# Altium schematic sheet Memory.SchDoc
size Letter; Author: Lihong; Chenwei; SheetNumber: 2; SheetTotal: 8
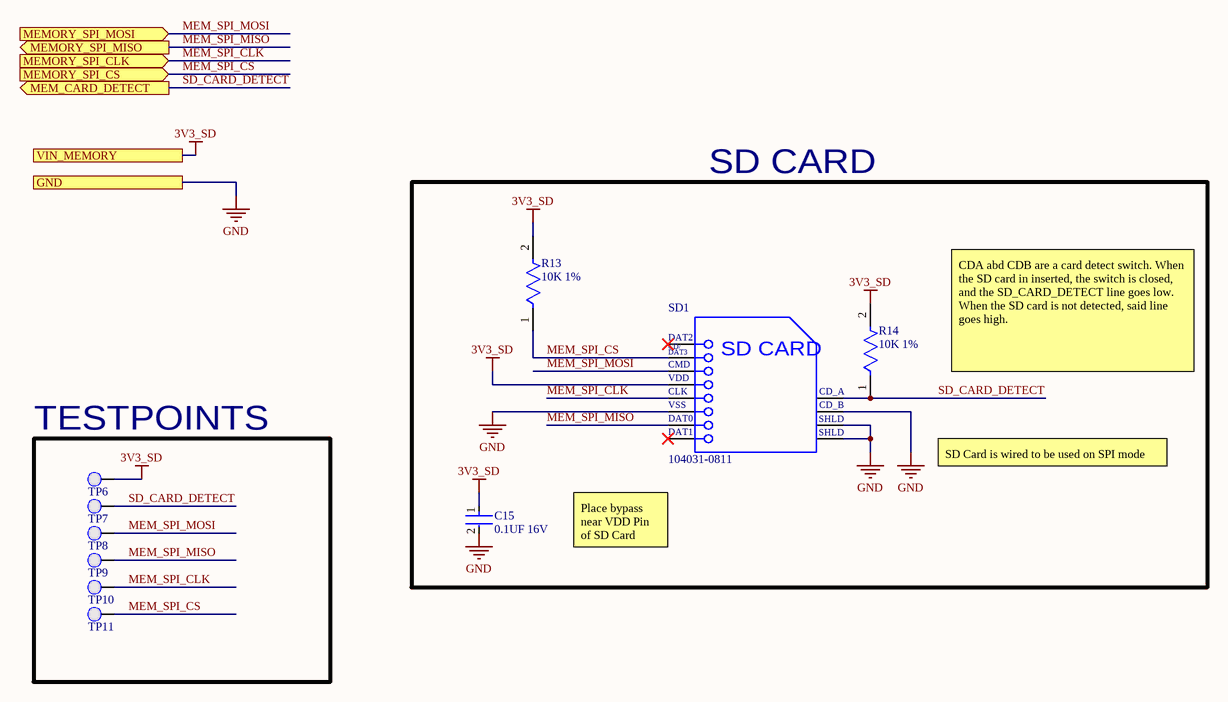
[diagram p0: Memory.SchDoc]

## Parts
C15  0.1UF 16V  [FP-CC0402-MFG]
R13  10K 1%  [FP-RNCP0603-IPC_A]
R14  10K 1%  [FP-RNCP0603-IPC_A]
SD1  104031-0811  [MOLX-104031-0811_V]
TP6  Test Point 0.1"  [Test Point 0.1"-Footprint-1]  (value not drawn)
TP7  Test Point 0.1"  [Test Point 0.1"-Footprint-1]  (value not drawn)
TP8  Test Point 0.1"  [Test Point 0.1"-Footprint-1]  (value not drawn)
TP9  Test Point 0.1"  [Test Point 0.1"-Footprint-1]  (value not drawn)
TP10  Test Point 0.1"  [Test Point 0.1"-Footprint-1]  (value not drawn)
TP11  Test Point 0.1"  [Test Point 0.1"-Footprint-1]  (value not drawn)

## Blocks framed on the sheet
SD CARD: C15 R13 R14 SD1
TESTPOINTS: TP6-TP11

## Ports
GND, MEM_CARD_DETECT (out), MEMORY_SPI_CLK (in), MEMORY_SPI_CS (in), MEMORY_SPI_MISO (out), MEMORY_SPI_MOSI (in), VIN_MEMORY

## Nets
3V3_SD: C15.1 R13.2 R14.2 SD1.4(VDD) TP6.1(PAD) ; port VIN_MEMORY
GND: C15.2 SD1.6(VSS2) SD1.10(CD_B) SD1.11(SHLD1) SD1.12(SHLD2) ; port GND
MEM_SPI_CLK: SD1.5(CLK) TP10.1(PAD) ; port MEMORY_SPI_CLK
MEM_SPI_CS: R13.1 SD1.2(CMD) TP11.1(PAD) ; port MEMORY_SPI_CS
MEM_SPI_MISO: SD1.7(DAT0) TP9.1(PAD) ; port MEMORY_SPI_MISO
MEM_SPI_MOSI: SD1.3(VSS1) TP8.1(PAD) ; port MEMORY_SPI_MOSI
SD_CARD_DETECT: R14.1 SD1.9(CD_A) TP7.1(PAD) ; port MEM_CARD_DETECT

Not connected (* = marked no-connect by the designer): SD1 1(CD/DAT3)* 8(DAT1)*

## Notes on the sheet
- CDA abd CDB are a card detect switch. When the SD card in inserted, the switch is closed, and the SD_CARD_DETECT line goes low. When the SD card is not detected, said line goes high.
- SD Card is wired to be used on SPI mode
- Place bypass near VDD Pin of SD Card
- Title:
- Desc:
- Size:
- Letter
- Auth:
- Proj:
- Sheet
- of
- www.seas.upenn.edu
- Electrical and Systems Engineering
- (in symbol CMP-2000-05825-1) DAT2; CD/; DAT3; SD CARD; VSS; SHLD

## Library data of the parts
C15 = CMP-03422-000946-1: CC0402 100 nF X7R 10.00% 25 V; Manufacturer Part Number: CC0402KPX7R8BB104; Manufacturer: YAGEO; Capacitance: 100 nF; Material: Ceramic; Tolerance: 0.1; Value: 100 nF; Temperature Coefficient: 30ppm/°C; Automotive Grade: NA; Voltage Rating: 25 V; Footprint Url: http://www.yageo.com/exep/pages/download/literatures/UPY-C_GEN_24.pdf; ComponentLink2Description: Datasheet; Device Class L2: Capacitors; Device Class L3: Ceramic Capacitors; Height: 0.55mm; Ipc Land Pattern Name: CAPC10050X50; Category: Cap; ComponentLink2URL: http://www.yageo.com/documents/recent/UPY-GP_NP0_16V-to-50V_16.pdf; Automotive: No; Temperature: -55°C to +125°C; Lead Free: Yes; Temperature Range High: +125°C; Temperature Range Low: -55°C; Temperature Characteristic: X7R; Package: CC0402; RoHS: TRUE; Octopart: https://octopart.com/cc0402kpx7r8bb104-yageo-61757486; Device Class L1: Passive Components
R13 R14 = CMP-26527-000099-1: 10kΩ ±1% 0.125W 0603 High Power Anti-Sulfur Thin Film Chip Resistor; Resistance: 10kR; Max Power Dissipation: 125mW; Temperature Coefficient: 100ppm/°C; Max Operating Temperature: 155°C; Width: 0.031inch; Height: 0.02inch; Lead Free: Lead Free; Contact Plating: Tin; Tolerance: 1%; Resistor Type: Thin Film; Series: RNCP; RoHS Compliant: Yes; Features: Moisture Resistant; Min Operating Temperature: -55°C; Case Code (Metric): 1608; Case/Package: 0603; Mount: Surface Mount; Packaging: Tape and Reel; Radiation Hardening: No; Length: 0.059inch; Number of Terminations: 2; Case Code (Imperial): 0603
SD1 = CMP-2000-05825-1: Micro SD Card, RA, -25 to 85 degC, 8-Pin SMD, RoHS, Tape and Reel; Voltage Rating: 10VAC/DC; Number of Contacts: 8; Insertion - Extraction Style: Push-Pull; Pitch: 1.1mm; Mating Cycles: 10000; Brand: Molex; Current Rating: 500mA; Manufacturer URL: http://www.molex.com/; Card Type: microSD; Mounting Type: Standard; Height: 1.42mm; Mounting Technology: SurfaceMount; Contact Plating: Gold; Product Category: MemoryCardConnectors; Package Description: 8-Pin Surface Mount Device, Body 11.95 x 11.4 mm, Pitch 1.1 mm; Datasheet URL: http://www.molex.com/pdm_docs/sd/1040310811_sd.pdf; Termination Style: SMD; Length: 11.4mm; Housing Material: LiquidCrystalPolymer(LCP); Orientation: RightAngle; RoHS: True; Contact Material: PhosphorBronze; Datasheet Version: Rev. E, 04/2006; Packaging: Reel; Manufacturer: Molex; Series: 104031; Product: CardConnectors; Number of Rows: 1Row; Package Reference: 104031-0811
TP6-TP11 = CMP-00086-1